# EasyEDA Pro project ProProject_IR sensor board_2024-06-21.epro, board PCB2 - newer_1
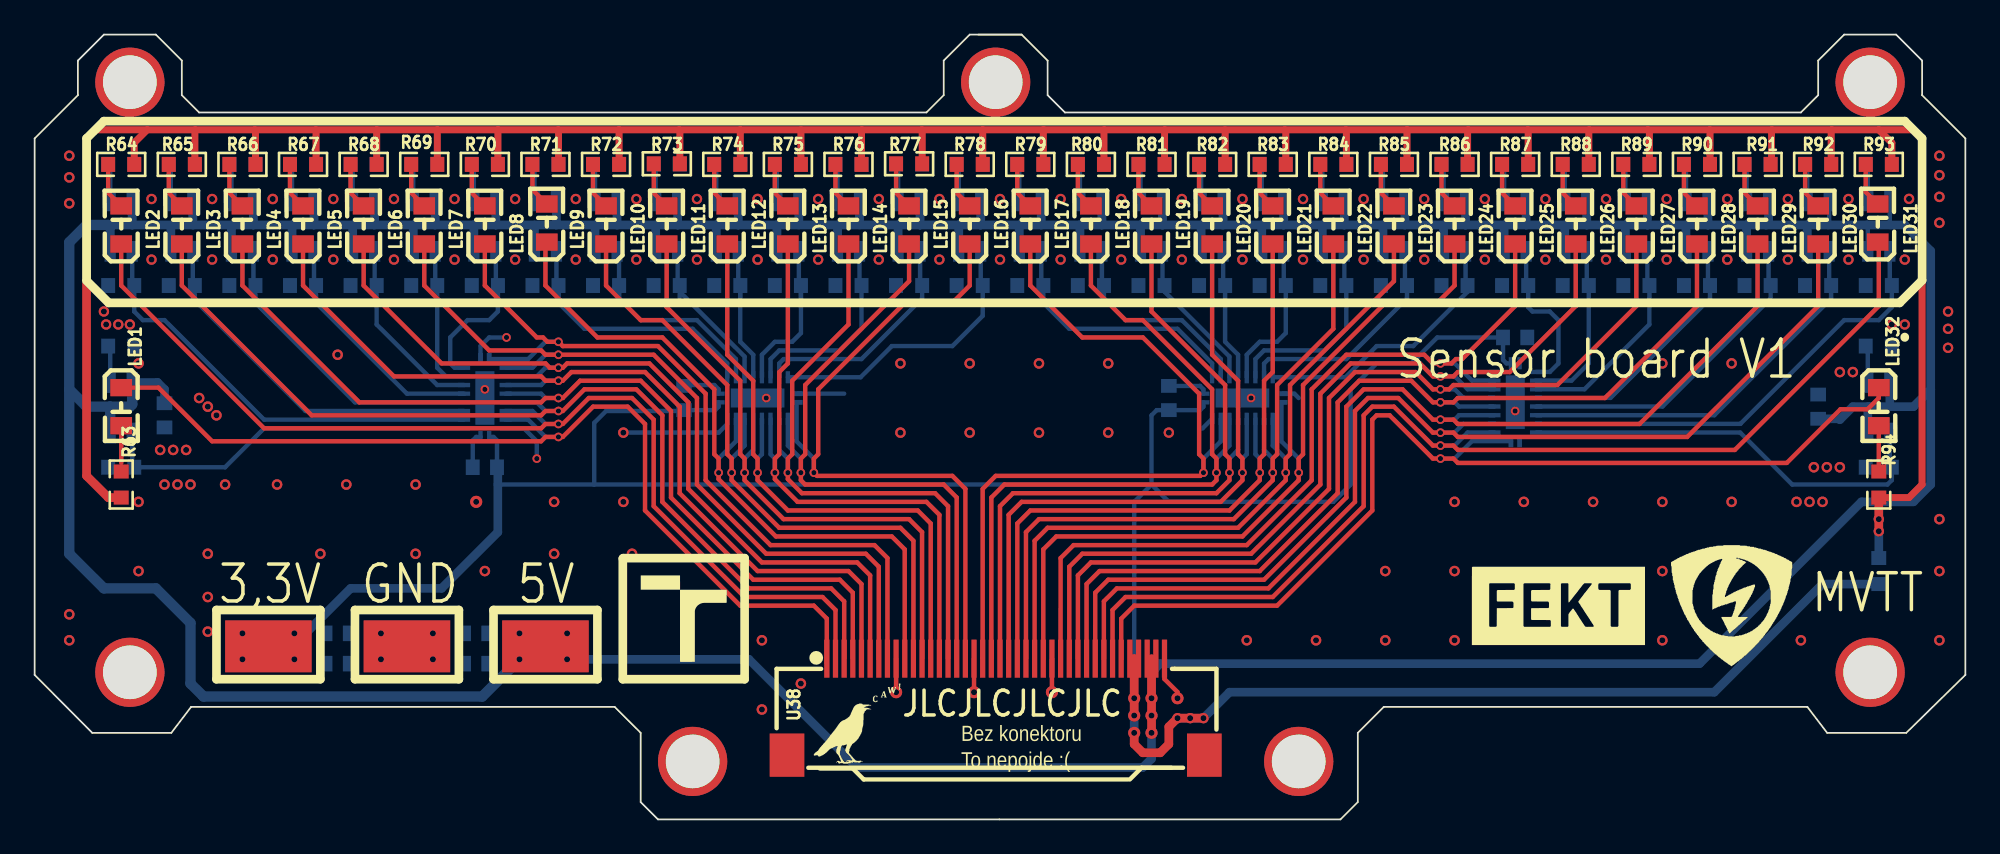
[diagram p7: board, top side]
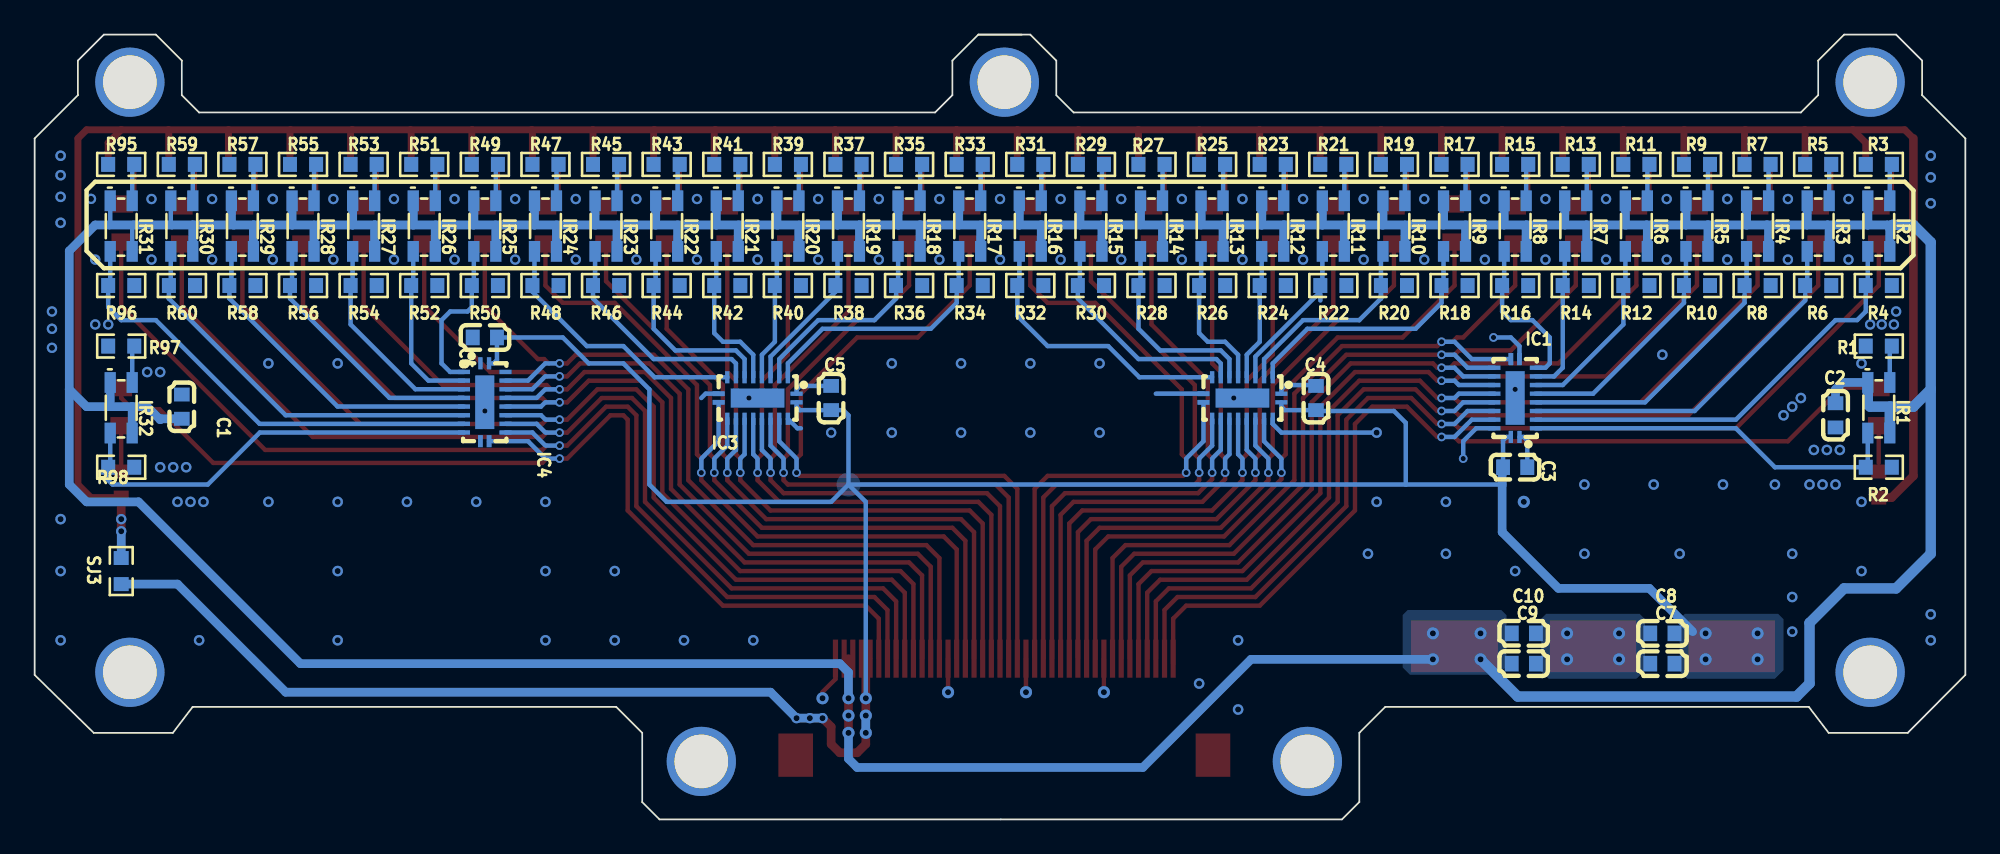
[diagram p8: board, bottom side, seen from below]

Outline 111.5 x 45.35 mm; copper layers: Top Layer, Bottom Layer. Coordinates in mm from the lower left corner of the outline.
Outline path: 54.5,45.35 57,45.35 ; 57,45.35 54,45.35 52.5,43.85 52.5,41.85 51.5,40.85 9.5,40.85 8.5,41.85 8.5,43.85 7,45.35 4,45.35 2.5,43.85 2.5,41.85 0,39.35 0,8.35 3.33,5 7.89,5 9.04,6.5 33.5,6.5 35,5 35,1 36,0 75.41,0 76.41,1 76.41,5 77.91,6.5 102.38,6.5 103.52,5 108.09,5 111.5,8.35 111.5,39.35 109,41.85 109,43.85 107.5,45.35 104.5,45.35 103,43.85 103,41.85 102,40.85 59.5,40.85 58.5,41.85 58.5,43.85 57,45.35
Stack: Top Layer 0.035mm / Dielectric1 1.51mm FR4 er 4.5 / Bottom Layer 0.035mm

## Design rules (mm)
template: JLCPCB Capability(Two Layers Board)
spacing copperThickness1oz (default): track to track 0.102, other pairs 0.152 to 0.3
spacing copperThickness2oz: track to track 0.203, other pairs 0.152 to 0.3
track width copperThickness1oz (default): min 0.127, default 0.254, max 2.54
track width copperThickness2oz: min 0.203, default 0.254, max 2.54
differential pair differentialPair (default): width min 0.127, default 0.254, max 2.54; gap min 0.152, default 0.152
via viaSize (default): diameter min 0.5, default 0.61, max 10; hole min 0.3, default 0.305, max 6.3

## Placement (name value [footprint] x y rotation side)
C1  100nF  [C0603]  103 23.85 90 bottom
C2  100nF  [C0603]  7.5 23.35 270 bottom
C3  100nF  [C0603]  26 20.35 180 bottom
C4  100nF  [C0603]  37.5 24.35 90 bottom
C5  100nF  [C0603]  65.5 24.35 90 bottom
C6  100nF  [C0603]  85.5 27.85 0 bottom
C7  1uF  [C0603]  17.5 9 0 bottom
C8  1uF  [C0603]  17.5 10.75 0 bottom
C9  1uF  [C0603]  25.5 9 180 bottom
C10  1uF  [C0603]  25.5 10.75 180 bottom
IC1  74AHC541BQ,115  [DHVQFN20_L4.5-W2.5-P0.50-BL-EP]  26 24.35 90 bottom
IC2  74AHC541BQ,115  [DHVQFN20_L4.5-W2.5-P0.50-BL-EP]  41.75 24.35 0 bottom
IC3  74AHC541BQ,115  [DHVQFN20_L4.5-W2.5-P0.50-BL-EP]  69.75 24.35 0 bottom
IC4  74AHC541BQ,115  [DHVQFN20_L4.5-W2.5-P0.50-BL-EP]  85.51 24.11 270 bottom
IR1  -  [KU163]  5 23.85 180 bottom
IR2  -  [KU163]  5 34.35 180 bottom
IR3  IR1  [KU163]  8.5 34.35 180 bottom
IR4  -  [KU163]  12 34.35 180 bottom
IR5  -  [KU163]  15.5 34.35 180 bottom
IR6  -  [KU163]  19 34.35 180 bottom
IR7  -  [KU163]  22.5 34.35 180 bottom
IR8  -  [KU163]  26 34.35 180 bottom
IR9  -  [KU163]  29.5 34.35 180 bottom
IR10  -  [KU163]  33 34.35 180 bottom
IR11  -  [KU163]  36.5 34.35 180 bottom
IR12  -  [KU163]  40 34.35 180 bottom
IR13  -  [KU163]  43.5 34.35 180 bottom
IR14  -  [KU163]  47 34.35 180 bottom
IR15  -  [KU163]  50.5 34.35 180 bottom
IR16  -  [KU163]  54 34.35 180 bottom
IR17  -  [KU163]  57.5 34.35 180 bottom
IR18  -  [KU163]  61 34.35 180 bottom
IR19  -  [KU163]  64.5 34.35 180 bottom
IR20  -  [KU163]  68 34.35 180 bottom
IR21  -  [KU163]  71.5 34.35 180 bottom
IR22  -  [KU163]  75 34.35 180 bottom
IR23  -  [KU163]  78.5 34.35 180 bottom
IR24  -  [KU163]  82 34.35 180 bottom
IR25  -  [KU163]  85.5 34.35 180 bottom
IR26  -  [KU163]  89 34.35 180 bottom
IR27  -  [KU163]  92.5 34.35 180 bottom
IR28  -  [KU163]  96 34.35 180 bottom
IR29  -  [KU163]  99.5 34.35 180 bottom
IR30  -  [KU163]  103 34.35 180 bottom
IR31  -  [KU163]  106.5 34.35 180 bottom
IR32  -  [KU163]  106.5 23.85 180 bottom
LED1  -  [LED0805-RD_GREEN]  5 23.85 270 top
LED2  -  [LED0805-RD_GREEN]  5 34.35 90 top
LED3  -  [LED0805-RD_GREEN]  8.5 34.35 90 top
LED4  -  [LED0805-RD_GREEN]  12 34.35 90 top
LED5  -  [LED0805-RD_GREEN]  15.5 34.35 90 top
LED6  -  [LED0805-RD_GREEN]  19 34.35 90 top
LED7  -  [LED0805-RD_GREEN]  22.5 34.35 90 top
LED8  -  [LED0805-RD_GREEN]  26 34.35 90 top
LED9  -  [LED0805-RD_GREEN]  29.58 34.46 90 top
LED10  -  [LED0805-RD_GREEN]  33 34.35 90 top
LED11  -  [LED0805-RD_GREEN]  36.5 34.35 90 top
LED12  -  [LED0805-RD_GREEN]  40 34.35 90 top
LED13  -  [LED0805-RD_GREEN]  43.5 34.35 90 top
LED14  -  [LED0805-RD_GREEN]  47 34.35 90 top
LED15  -  [LED0805-RD_GREEN]  50.5 34.35 90 top
LED16  -  [LED0805-RD_GREEN]  54 34.35 90 top
LED17  -  [LED0805-RD_GREEN]  57.5 34.35 90 top
LED18  -  [LED0805-RD_GREEN]  61 34.35 90 top
LED19  -  [LED0805-RD_GREEN]  64.5 34.35 90 top
LED20  -  [LED0805-RD_GREEN]  68 34.35 90 top
LED21  -  [LED0805-RD_GREEN]  71.5 34.35 90 top
LED22  -  [LED0805-RD_GREEN]  75 34.35 90 top
LED23  -  [LED0805-RD_GREEN]  78.5 34.35 90 top
LED24  -  [LED0805-RD_GREEN]  82 34.35 90 top
LED25  -  [LED0805-RD_GREEN]  85.5 34.35 90 top
LED26  -  [LED0805-RD_GREEN]  89 34.35 90 top
LED27  -  [LED0805-RD_GREEN]  92.5 34.35 90 top
LED28  -  [LED0805-RD_GREEN]  96 34.35 90 top
LED29  -  [LED0805-RD_GREEN]  99.5 34.35 90 top
LED30  -  [LED0805-RD_GREEN]  103 34.35 90 top
LED31  -  [LED0805-RD_GREEN]  106.44 34.46 90 top
LED32  -  [LED0805-RD_GREEN]  106.5 23.85 270 top
NOREF  -  [Pad_e8276]  106 42.6 0 top
NOREF#2  -  [Pad_e8278]  5.5 42.6 0 top
NOREF#3  -  [Pad_e223]  73 3.35 0 top
NOREF#4  -  [Pad_e8274]  55.5 42.6 0 top
NOREF#5  -  [Pad_e4472]  21.5 10 0 top
NOREF#6  -  [Pad_e4581]  13.5 10 0 top
NOREF#7  -  [Pad_e217]  38 3.35 0 top
NOREF#8  -  [Pad_e4440]  5.5 8.5 0 top
NOREF#9  -  [Pad_e4442]  106 8.5 0 top
NOREF#10  -  [Pad_e4480]  29.5 10 0 top
R1  680R  [R0603]  5 27.35 0 bottom
R2  6.2k  [R0603]  5 20.35 0 bottom
R3  680R  [R0603]  5 37.85 0 bottom
R4  6.2k  [R0603]  5 30.85 0 bottom
R5  680R  [R0603]  8.5 37.85 0 bottom
R6  6.2k  [R0603]  8.5 30.85 0 bottom
R7  680R  [R0603]  12 37.85 0 bottom
R8  6.2k  [R0603]  12 30.85 0 bottom
R9  680R  [R0603]  15.5 37.85 0 bottom
R10  6.2k  [R0603]  15.5 30.85 0 bottom
R11  680R  [R0603]  19 37.85 0 bottom
R12  6.2k  [R0603]  19 30.85 0 bottom
R13  680R  [R0603]  22.5 37.85 0 bottom
R14  6.2k  [R0603]  22.5 30.85 0 bottom
R15  680R  [R0603]  26 37.85 0 bottom
R16  6.2k  [R0603]  26 30.85 0 bottom
R17  680R  [R0603]  29.5 37.85 0 bottom
R18  6.2k  [R0603]  29.5 30.85 0 bottom
R19  680R  [R0603]  33 37.85 0 bottom
R20  6.2k  [R0603]  33 30.85 0 bottom
R21  680R  [R0603]  36.5 37.85 0 bottom
R22  6.2k  [R0603]  36.5 30.85 0 bottom
R23  680R  [R0603]  40 37.85 0 bottom
R24  6.2k  [R0603]  40 30.85 0 bottom
R25  680R  [R0603]  43.5 37.85 0 bottom
R26  6.2k  [R0603]  43.5 30.85 0 bottom
R27  680R  [R0603]  47 37.85 0 bottom
R28  6.2k  [R0603]  47 30.85 0 bottom
R29  680R  [R0603]  50.5 37.85 0 bottom
R30  6.2k  [R0603]  50.5 30.85 0 bottom
R31  680R  [R0603]  54 37.85 0 bottom
R32  6.2k  [R0603]  54 30.85 0 bottom
R33  680R  [R0603]  57.5 37.85 0 bottom
R34  6.2k  [R0603]  57.5 30.85 0 bottom
R35  680R  [R0603]  61 37.85 0 bottom
R36  6.2k  [R0603]  61 30.85 0 bottom
R37  680R  [R0603]  64.5 37.85 0 bottom
R38  6.2k  [R0603]  64.5 30.85 0 bottom
R39  680R  [R0603]  68 37.85 0 bottom
R40  6.2k  [R0603]  68 30.85 0 bottom
R41  680R  [R0603]  71.5 37.85 0 bottom
R42  6.2k  [R0603]  71.5 30.85 0 bottom
R43  680R  [R0603]  75 37.85 0 bottom
R44  6.2k  [R0603]  75 30.85 0 bottom
R45  680R  [R0603]  78.5 37.85 0 bottom
R46  6.2k  [R0603]  78.5 30.85 0 bottom
R47  680R  [R0603]  82 37.85 0 bottom
R48  6.2k  [R0603]  82 30.85 0 bottom
R49  680R  [R0603]  85.5 37.85 0 bottom
R50  6.2k  [R0603]  85.5 30.85 0 bottom
R51  680R  [R0603]  89 37.85 0 bottom
R52  6.2k  [R0603]  89 30.85 0 bottom
R53  680R  [R0603]  92.5 37.85 0 bottom
R54  6.2k  [R0603]  92.5 30.85 0 bottom
R55  680R  [R0603]  96 37.85 0 bottom
R56  6.2k  [R0603]  96 30.85 0 bottom
R57  680R  [R0603]  99.5 37.85 0 bottom
R58  6.2k  [R0603]  99.5 30.85 0 bottom
R59  680R  [R0603]  103 37.85 0 bottom
R60  6.2k  [R0603]  102.99 30.85 0 bottom
R63  1k  [R0603]  5 19.35 270 top
R64  1k  [R0603]  5 37.85 0 top
R65  1k  [R0603]  8.5 37.85 0 top
R66  1k  [R0603]  12 37.85 0 top
R67  1k  [R0603]  15.5 37.85 0 top
R68  1k  [R0603]  19 37.85 0 top
R69  1k  [R0603]  22.5 37.85 0 top
R70  1k  [R0603]  26 37.85 0 top
R71  1k  [R0603]  29.5 37.85 0 top
R72  1k  [R0603]  33 37.85 0 top
R73  1k  [R0603]  36.51 37.89 0 top
R74  1k  [R0603]  40 37.85 0 top
R75  1k  [R0603]  43.5 37.85 0 top
R76  1k  [R0603]  47 37.85 0 top
R77  1k  [R0603]  50.5 37.89 0 top
R78  1k  [R0603]  54 37.85 0 top
R79  1k  [R0603]  57.5 37.85 0 top
R80  1k  [R0603]  61 37.85 0 top
R81  1k  [R0603]  64.5 37.85 0 top
R82  1k  [R0603]  68 37.85 0 top
R83  1k  [R0603]  71.5 37.85 0 top
R84  1k  [R0603]  75 37.85 0 top
R85  1k  [R0603]  78.5 37.85 0 top
R86  1k  [R0603]  82 37.85 0 top
R87  1k  [R0603]  85.5 37.85 0 top
R88  1k  [R0603]  89 37.85 0 top
R89  1k  [R0603]  92.5 37.85 0 top
R90  1k  [R0603]  96 37.85 0 top
R91  1k  [R0603]  99.5 37.85 0 top
R92  1k  [R0603]  103 37.85 0 top
R93  1k  [R0603]  106.5 37.85 0 top
R94  1k  [R0603]  106.5 19.35 270 top
R95  680R  [R0603]  106.5 37.85 0 bottom
R96  6.2k  [R0603]  106.5 30.85 0 bottom
R97  680R  [R0603]  106.5 27.35 0 bottom
R98  6.2k  [R0603]  106.5 20.35 0 bottom
SJ3  10K  [R0603]  106.5 14.35 270 bottom
U38  XDFC-0520-40P  [CONN-SMD_40P-P0.50_F31L-1A7H1-21040]  55.5 6.5 0 top

## Footprints (pads in the part's own frame, mm; a bottom-side part is the same pattern mirrored in y, then rotated)
C0603
  rect 0.8x0.9 smd: 1(-0.7,0) 2(0.7,0)
CONN-SMD_40P-P0.50_F31L-1A7H1-21040
  rect 0.3x2.2 smd: 1(-9.75,2.788) 2(-9.25,2.788) 3(-8.75,2.788) 4(-8.25,2.788) 5(-7.75,2.788) 6(-7.25,2.788) 7(-6.75,2.788) 8(-6.25,2.788) 9(-5.75,2.788) 10(-5.25,2.788) 11(-4.75,2.788) 12(-4.25,2.788) 13(-3.75,2.788) 14(-3.25,2.788) 15(-2.75,2.788) 16(-2.25,2.788) 17(-1.75,2.788) 18(-1.25,2.788) 19(-0.75,2.788) 20(-0.25,2.788) 21(0.25,2.788) 22(0.75,2.788) 23(1.25,2.788) 24(1.75,2.788) 25(2.25,2.788) 26(2.75,2.788) 27(3.25,2.788) 28(3.75,2.788) 29(4.25,2.788) 30(4.75,2.788) 31(5.25,2.788) 32(5.75,2.788) 33(6.25,2.788) 34(6.75,2.788) 35(7.25,2.788) 36(7.75,2.788) 37(8.25,2.788) 38(8.75,2.788) 39(9.25,2.788) 40(9.75,2.788)
  rect 2x2.5 smd: 41(-12.05,-2.788) 42(12.05,-2.788)
DHVQFN20_L4.5-W2.5-P0.50-BL-EP
  rect 0.7x0.25 smd: 1(-2.251,-0.249) 20(-2.251,0.249)
  rect 0.25x0.7 smd: 2(-1.75,-1.2) 3(-1.25,-1.2) 4(-0.75,-1.2) 5(-0.25,-1.2) 6(0.25,-1.2) 7(0.75,-1.2) 8(1.25,-1.2) 9(1.75,-1.2) 12(1.75,1.2) 13(1.25,1.2) 14(0.75,1.2) 15(0.25,1.2) 16(-0.25,1.2) 17(-0.75,1.2) 18(-1.25,1.2) 19(-1.75,1.2)
  rect 0.7x0.28 smd: 10(2.251,-0.249) 11(2.251,0.251)
  rect 3.1x1.1 smd: 21(0,0.001)
KU163
  rect 0.65x1.2 smd: 1(-0.635,1.397) 2(0.635,1.397) 3(-0.635,-1.524) 4(0.635,-1.524)
LED0805-RD_GREEN
  rect 1x1.25 smd: 1(-1.1,0) 2(1.1,0)
Pad_e217
  round 4 hole 3.1: 1(0,0)
Pad_e223
  round 4 hole 3.1: 1(0,0)
Pad_e4440
  round 4 hole 3.1: 1(0,0)
Pad_e4442
  round 4 hole 3.1: 1(0,0)
Pad_e4472
  rect 5x3 smd: 2(0,0)
Pad_e4480
  rect 5x3 smd: 43(0,0)
Pad_e4581
  rect 5x3 smd: 44(0,0)
Pad_e8274
  round 4 hole 3.1: 45(0,0)
Pad_e8276
  round 4 hole 3.1: 45(0,0)
Pad_e8278
  round 4 hole 3.1: 45(0,0)
R0603
  rect 0.806x0.864 smd: 1(-0.753,0) 2(0.753,0)

## Nets
As in the schematic, except:
+5V: C1.1 C2.1 C9.1 C10.1 IR1.1 IR1.4 IR2.1 IR2.4 IR3.1 IR3.4 IR4.1 IR4.4 IR5.1 IR5.4 IR6.1 IR6.4 IR7.1 IR7.4 IR8.1 IR8.4 IR9.1 IR9.4 IR10.1 IR10.4 IR11.1 IR11.4 IR12.1 IR12.4 IR13.1 IR13.4 IR14.1 IR14.4 IR15.1 IR15.4 IR16.1 IR16.4 IR17.1 IR17.4 IR18.1 IR18.4 IR19.1 IR19.4 IR20.1 IR20.4 IR21.1 IR21.4 IR22.1 IR22.4 IR23.1 IR23.4 IR24.1 IR24.4 IR25.1 IR25.4 IR26.1 IR26.4 IR27.1 IR27.4 IR28.1 IR28.4 IR29.1 IR29.4 IR30.1 IR30.4 IR31.1 IR31.4 IR32.1 IR32.4 NOREF#10.43 U38.38 U38.39
AGND: C1.2 C2.2 C3.2 C4.2 C5.2 C6.2 C7.2 C8.2 C9.2 C10.2 IC1.1 IC1.10 IC1.19 IC1.21 IC2.1 IC2.10 IC2.19 IC2.21 IC3.1 IC3.10 IC3.19 IC3.21 IC4.1 IC4.10 IC4.19 IC4.21 NOREF.45 NOREF#2.45 NOREF#3.1 NOREF#4.45 NOREF#5.2 NOREF#7.1 NOREF#8.1 NOREF#9.1 R1.2 R2.1 R3.2 R4.1 R5.2 R6.1 R7.2 R8.1 R9.2 R10.1 R11.2 R12.1 R13.2 R14.1 R15.2 R16.1 R17.2 R18.1 R19.2 R20.1 R21.2 R22.1 R23.2 R24.1 R25.2 R26.1 R27.2 R28.1 R29.2 R30.1 R31.2 R32.1 R33.2 R34.1 R35.2 R36.1 R37.2 R38.1 R39.2 R40.1 R41.2 R42.1 R43.2 R44.1 R45.2 R46.1 R47.2 R48.1 R49.2 R50.1 R51.2 R52.1 R53.2 R54.1 R55.2 R56.1 R57.2 R58.1 R59.2 R60.1 R95.2 R96.1 R97.2 R98.1 U38.9 U38.18 U38.27 U38.40
VCC: C3.1 C4.1 C5.1 C6.1 C7.1 C8.1 IC1.20 IC2.20 IC3.20 IC4.20 NOREF#6.44 SJ3.2 U38.36 U38.37

Pads without a net: U38 41 42

## Via types
v1: diameter 0.7, hole 0.35, Top Layer to Bottom Layer, 23 vias
v2: diameter 0.61, hole 0.35, Top Layer to Bottom Layer, 83 vias
v3: diameter 0.6, hole 0.35, Top Layer to Bottom Layer, 67 vias
v4: diameter 0.5, hole 0.3, Top Layer to Bottom Layer, 38 vias

## Routing (per net, layer and track width the routed paths; a pad name or vN(x,y) marks a point on that pad's centre or on a via; arc(x,y) is an arc through that point)
+5V: length 374
  Top Layer w0.254: U38.38 U38.39
  Top Layer w0.5: v1(64.5,5) v1(64.5,6) v1(64.5,7) 64.5,7 64.5,9.29
  Bottom Layer w0.254: IR31.1 107.13,34.39 107.18,34.35 ; IR30.1 103.63,34.4 103.58,34.35 ; IR31.4 105.87,34.29 105.8,34.35
  Bottom Layer w0.5: 107.18,34.35 108,34.35 109.5,32.85 109.5,24.85 ; C1.1 104.2,23.15 104.25,23.1 105,23.85 105.88,23.85 ; 109.5,24.85 108.5,23.85 107.16,23.85 ; 109.5,24.85 109.5,19.35 108.5,18.35 105.5,18.35 96.15,9 65,9 64.5,8.5 v1(64.5,7) ; IR32.1 107.13,23.87 107.16,23.85 ; 105.88,23.85 105.87,23.83 IR32.4 ; 105.88,23.85 107.16,23.85 ; v1(64.5,5) 64.5,3.5 64,3 47.5,3 41.25,9.25 v1(30.75,9.25) ; C2.1 7.5,24.85 7.1,25.25 IR1.1
  Bottom Layer w0.508: IR11.1 37.13,34.35 37.14,34.35 ; 86.15,34.35 86.13,34.36 IR25.1 ; 86.15,34.35 89.64,34.35 ; 86.15,34.35 82.64,34.35 ; IR26.4 88.37,34.35 ; 33.65,34.35 30.14,34.35 ; 33.65,34.35 37.14,34.35 ; 33.65,34.35 33.63,34.36 IR10.1 ; 30.14,34.35 IR9.1 ; 30.14,34.35 26.64,34.35 ; 40.63,34.35 40.63,34.35 IR12.1 ; 40.63,34.35 42.86,34.35 ; 40.63,34.35 39.36,34.35 ; 9.15,34.35 9.14,34.36 IR3.1 ; 9.15,34.35 11.46,34.35 ; 9.15,34.35 7.96,34.35 ; 93.14,34.35 91.87,34.35 ; 93.14,34.35 96.63,34.35 ; 93.14,34.35 93.13,34.35 IR27.1 ; 91.87,34.35 91.87,34.35 IR27.4 ; 91.87,34.35 89.64,34.35 ; 61.63,34.35 61.63,34.36 IR18.1 ; 61.63,34.35 63.87,34.35 ; 61.63,34.35 60.37,34.35 ; 25.36,34.35 23.12,34.35 ; 25.36,34.35 25.36,34.34 IR8.4 ; 25.36,34.35 26.64,34.35 ; 23.12,34.35 21.89,34.35 ; 23.12,34.35 23.14,34.36 IR7.1 ; 102.37,34.35 107.18,34.35 ; 79.12,34.35 75.63,34.35 ; 79.12,34.35 82.64,34.35 ; 79.12,34.35 79.13,34.37 IR23.1 ; 75.63,34.35 75.63,34.36 IR22.1 ; 75.63,34.35 72.13,34.35 ; 5.64,34.35 4.5,34.35 4.36,34.21 IR2.4 ; 5.64,34.35 7.96,34.35 ; 5.64,34.35 5.64,34.35 IR2.1 ; 12.63,34.35 12.64,34.36 IR4.1 ; 12.63,34.35 11.46,34.35 ; 12.63,34.35 14.88,34.35 ; IR28.1 96.63,34.35 96.63,34.35 ; IR24.4 81.37,34.35 ; 42.86,34.35 42.87,34.34 IR13.4 ; 42.86,34.35 49.87,34.35 ; IR29.4 98.87,34.34 98.86,34.35 ; IR20.1 68.63,34.37 68.61,34.35 ; 82.64,34.35 82.63,34.35 IR24.1 ; 18.41,34.35 16.13,34.35 ; 18.41,34.35 19.61,34.35 ; 18.41,34.35 18.36,34.3 IR6.4 ; 16.13,34.35 14.88,34.35 ; 16.13,34.35 16.14,34.36 IR5.1 ; IR21.4 70.87,34.35 ; 19.61,34.35 19.64,34.37 IR6.1 ; 19.61,34.35 21.89,34.35 ; 96.63,34.35 98.86,34.35 ; 54.63,34.35 53.37,34.35 ; 54.63,34.35 54.63,34.35 IR16.1 ; 54.63,34.35 58.13,34.35 ; 53.37,34.35 53.37,34.35 IR16.4 ; 53.37,34.35 51.13,34.35 ; IR20.4 67.37,34.35 ; IR29.1 100.13,34.48 100,34.35 ; 49.87,34.35 49.87,34.35 IR15.4 ; 49.87,34.35 51.13,34.35 ; IR3.4 7.86,34.25 7.96,34.35 ; 65.14,34.35 63.87,34.35 ; 65.14,34.35 65.13,34.35 IR19.1 ; 65.14,34.35 68.61,34.35 ; 63.87,34.35 63.87,34.35 IR19.4 ; 14.88,34.35 14.86,34.34 IR5.4 ; 37.14,34.35 39.36,34.35 ; IR14.4 46.37,34.35 ; 11.46,34.35 11.36,34.26 IR4.4 ; IR11.4 35.87,34.35 ; 51.13,34.35 51.13,34.35 IR15.1 ; 89.64,34.35 89.63,34.36 IR26.1 ; IR30.4 102.37,34.35 100,34.35 ; IR28.4 95.37,34.35 ; 39.36,34.35 39.37,34.35 IR12.4 ; 58.13,34.35 60.37,34.35 ; 58.13,34.35 IR17.1 ; 72.13,34.35 72.13,34.35 IR21.1 ; 72.13,34.35 68.61,34.35 ; 21.89,34.35 21.86,34.33 IR7.4 ; 60.37,34.35 60.37,34.34 IR18.4 ; IR25.4 84.87,34.35 ; 100,34.35 98.86,34.35 ; IR13.1 44.13,34.35 ; IR17.4 56.87,34.35 ; IR22.4 74.37,34.35 ; IR9.4 28.86,34.35 ; IR14.1 47.63,34.35 ; IR23.4 77.87,34.35 ; 26.64,34.35 26.64,34.36 IR8.1 ; IR10.4 32.37,34.35
  Bottom Layer w0.6: 4.36,34.21 4.23,34.35 3,34.35 2,33.35 2,24.85 ; 2,24.85 2,15.35 4,13.35 7,13.35 9,11.35 9,7.85 9.75,7.1 25.85,7.1 v1(28,9.25) ; 2,24.85 3,23.85 4.36,23.85 ; IR1.1 5.64,23.98 5.5,23.85 4.36,23.85 ; IR1.4 4.36,23.84 4.36,23.85
  vias: v1(28,10.75) v1(30.75,10.75)
AGND: length 32.1
  Top Layer w0.254: v1(58.75,7.35) U38.27 ; v1(49.75,7.35) U38.9 ; U38.40 65.25,8.11 66,7.36 v1(66,7) ; v1(54.25,7.35) U38.18
  Bottom Layer w0.254: 73,24.35 72.75,24.6 IC3.10 ; IC3.19 67.45,22.6 67.25,22.6 ; IC1.19 28.25,22.6 29,21.85 v4(29,20.85) ; IC1.10 25.75,27.35 26.25,27.85 v4(27.25,27.85) ; v2(34,22.35) 39.5,22.35 40,22.85 IC2.19 ; IC2.1 39.5,24.85 39.25,25.1 37.55,25.1 C4.2 ; IC1.1 25.5,22.1 25.3,21.9 C3.2 ; IC2.10 46.75,24.6 ; C5.2 67.3,25.05 67.5,24.85 IC3.1
  vias: v1(20,10.75) v1(20,9.25) v1(23,10.75) v1(23,9.25) v1(25.5,18.35) v2(2,38.35) v2(2,37.1) v2(2,35.6) v2(2,11.85) v2(2,10.35) v2(6,26.35) v2(6,18.35) v2(6,14.35) v2(7.25,21.35) v2(7.5,19.35) v2(8,21.35) v2(8.25,19.35) v2(8.75,21.35) v2(9,19.35) v2(9.5,24.35) v2(10,23.85) v2(10,15.35) v2(10,12.85) v2(10,10.85) v2(10.5,23.35) v2(11,19.35) v2(13.75,35.85) v2(13.75,32.35) v2(14,19.35) v2(16.5,15.35) v2(17.5,26.85) v2(18,19.35) v2(22,19.35) v2(22,15.35) v2(26,14.35) v2(30,18.35) v2(30,15.35) v2(34,18.35) v2(34.5,15.35) v2(41.75,35.85) v2(41.75,32.35) v2(42,10.35) v2(42,6.35) v2(44.25,7.85) v2(50,26.35) v2(50,22.35) v2(54,26.35) v2(54,22.35) v2(58,26.35) v2(58,22.35) v2(62,26.35) v2(62,22.35) v2(69.75,35.85) v2(69.75,32.35) v2(70,10.35) v2(74,10.35) v2(78,14.35) v2(78,10.35) v2(82,18.35) v2(82,14.35) v2(82,10.35) v2(86,18.35) v2(90,18.35) v2(94,26.35) v2(94,18.35) v2(94,14.35) v2(94,10.35) v2(97.75,32.35) v2(97.75,35.85) v2(98,26.35) v2(98,18.35) v2(101.75,18.35) v2(102,10.35) v2(102.5,18.35) v2(102.75,20.35) v2(103.25,18.35) v2(103.5,20.35) v2(104.25,25.85) v2(104.25,20.35) v2(105,25.85) v2(110,38.35) v2(110,37.22) v2(110,35.97) v2(110,34.47) v2(110,17.35) v2(110,14.35) v2(110,10.35) v3(4,29.35) v3(4.13,28.6) v3(4.83,28.6) v3(5.5,28.6) v3(6.75,35.85) v3(6.75,32.35) v3(10.25,35.85) v3(10.25,32.35) v3(17.25,35.85) v3(17.25,32.35) v3(20.75,35.85) v3(20.75,32.35) v3(24.25,35.85) v3(24.25,32.35) v3(27.75,35.85) v3(27.75,32.35) v3(31.25,35.85) v3(31.25,32.35) v3(34.75,35.85) v3(34.75,32.35) v3(38.25,35.85) v3(38.25,32.35) v3(45.25,35.85) v3(45.25,32.35) v3(48.75,35.85) v3(48.75,32.35) v3(52.25,35.85) v3(52.25,32.35) v3(55.75,35.85) v3(55.75,32.35) v3(59.25,35.85) v3(59.25,32.35) v3(62.75,35.85) v3(62.75,32.35) v3(65.5,22.35) v3(66.25,35.85) v3(66.25,32.35) v3(73.25,35.85) v3(73.25,32.35) v3(76.75,32.35) v3(76.75,35.85) v3(80.25,35.85) v3(80.25,32.35) v3(83.75,32.35) v3(83.75,35.85) v3(87.25,35.85) v3(87.25,32.35) v3(90.75,32.35) v3(90.75,35.85) v3(94.25,35.85) v3(94.25,32.35) v3(101.25,35.85) v3(101.25,32.35) v3(104.75,32.35) v3(104.75,35.85) v3(107.25,28.6) v3(108,32.35) v3(108,28.6) v3(108.25,35.86) v3(110.5,29.35) v3(110.5,28.35) v3(110.5,27.25) v4(26,24.85) v4(42.25,24.35) v4(70.25,24.35) v4(85.5,23.6)
VCC: length 172.6
  Top Layer w0.254: U38.37 U38.36
  Top Layer w0.5: v3(67.5,5.85) v3(66.73,5.85) v3(66,5.85) 65.5,5.35 65.5,4.35 65,3.85 64,3.85 63.5,4.35 v1(63.5,5) ; v1(63.5,6) v1(63.5,7) 63.5,9.28 63.5,9.29
  Bottom Layer w0.254: IC3.20 67.5,23.85 67.3,23.65 66,23.65 ; C3.1 26.7,21.9 26.5,22.1 IC1.20 ; v1(63.5,7) 63.5,18.35 64.5,19.35 ; IC2.20 39.5,23.85 39.3,23.65 C4.1 37.45,23.6 33,23.6 32.32,22.92 32.32,19.35 ; 64.5,19.35 65.5,18.35 75,18.35 76,19.35 76,24.85 77.5,26.35 79.5,26.35 81,27.85 C6.1 84.8,26.55 85,26.35 85.25,26.35 IC4.20 ; 64.5,19.35 64.5,23.35 64.8,23.65 C5.1 ; 64.5,19.35 32.32,19.35 ; 32.32,19.35 26.75,19.35
  Bottom Layer w0.5: C3.1 26.75,20.3 26.75,16.6 23.5,13.35 18.25,13.35 15.75,10.85 ; v1(63.5,5) v1(63.5,6) ; v3(66,5.85) v3(66.73,5.85) v3(67.5,5.85) 69,7.35 97,7.35 103.25,13.6 SJ3.2
  vias: v1(12,10.75) v1(12,9.25) v1(15,10.75) v1(15,9.25)
DIR1: length 56.9
  Top Layer w0.254: 45.75,9 45.75,11.6 45,12.35 40.75,12.35 35.25,17.85 35.25,22.85 34.25,23.85 32.25,23.85 30.5,22.1 v4(30.25,22.1) 29.5,22.1 29.25,21.85 10.25,21.85 7.15,24.95 LED1.1
  Bottom Layer w0.254: v4(30.25,22.1) 29.5,22.1 28.5,23.1 IC1.18
DIR2: length 62
  Top Layer w0.254: LED2.1 5,30.85 13.25,22.6 29.25,22.6 29.5,22.85 v4(30.25,22.85) 30.5,22.85 32,24.35 34.5,24.35 35.75,23.1 35.75,18.1 41,12.85 45.5,12.85 46.25,12.1 U38.2
  Bottom Layer w0.254: v4(30.25,22.85) 29.5,22.85 28.75,23.6 IC1.17
DIR3: length 59
  Top Layer w0.254: LED3.1 8.5,30.85 16,23.35 29.25,23.35 29.5,23.6 v4(30.25,23.6) 30.5,23.6 31.75,24.85 34.75,24.85 36.25,23.35 36.25,18.35 41.25,13.35 46,13.35 46.75,12.6 U38.3
  Bottom Layer w0.254: IC1.16 29,24.1 29.5,23.6 v4(30.25,23.6)
DIR4: length 55.9
  Top Layer w0.254: LED4.1 12,30.85 18.75,24.1 29.25,24.1 29.5,24.35 v4(30.25,24.35) 30.5,24.35 31.5,25.35 35,25.35 36.75,23.6 36.75,18.6 41.5,13.85 46.5,13.85 47.25,13.1 U38.4
  Bottom Layer w0.254: v4(30.25,24.35) 29.5,24.35 29.25,24.6 IC1.15
DIR5: length 52.6
  Top Layer w0.254: U38.5 47.75,13.6 47,14.35 41.75,14.35 37.25,18.85 37.25,23.85 35.25,25.85 31,25.85 30.5,25.35 v4(30.25,25.35) 29.5,25.35 29.25,25.6 20.75,25.6 15.5,30.85 LED5.1
  Bottom Layer w0.254: v4(30.25,25.35) 29.5,25.35 29.25,25.1 IC1.14
DIR6: length 49.8
  Top Layer w0.254: U38.6 48.25,14.1 47.5,14.85 42,14.85 37.75,19.1 37.75,24.1 35.5,26.35 30.75,26.35 30.5,26.1 v4(30.25,26.1) 29.75,26.1 29.5,26.35 23.5,26.35 19,30.85 LED6.1
  Bottom Layer w0.254: IC1.13 29,25.6 29.5,26.1 v4(30.25,26.1)
DIR7: length 47
  Top Layer w0.254: U38.7 48.75,14.6 48,15.35 42.25,15.35 38.25,19.35 38.25,24.35 35.75,26.85 v4(30.25,26.85) 29.5,26.85 29.25,27.1 26.25,27.1 22.5,30.85 LED7.1
  Bottom Layer w0.254: IC1.12 28.75,26.1 29.5,26.85 v4(30.25,26.85)
DIR8: length 45.3
  Top Layer w0.254: U38.8 49.25,15.1 48.5,15.85 42.5,15.85 38.75,19.6 38.75,24.6 36,27.35 30.5,27.35 v4(30.25,27.6) 29.61,27.6 29.36,27.85 29,27.85 26,30.85 LED8.1
  Bottom Layer w0.254: v4(30.25,27.6) 29.5,27.6 28.5,26.6 IC1.11
DIR9: length 42.3
  Top Layer w0.254: LED9.1 29.5,33.28 29.5,30.85 32.5,27.85 36.25,27.85 39.25,24.85 39.25,21.1 39.5,20.85 v4(39.5,20.04) 39.5,19.66 42.81,16.35 49.5,16.35 50.25,15.6 U38.10
  Bottom Layer w0.254: IC2.18 40.5,21.85 39.5,20.85 ; 39.5,20.79 v4(39.5,20.04)
DIR10: length 39.5
  Top Layer w0.254: U38.11 50.75,16.1 50,16.85 43,16.85 40.25,19.6 v4(40.25,20.04) 40.25,20.85 40,21.1 40,25.1 36.25,28.85 35,28.85 33,30.85 LED10.1
  Bottom Layer w0.254: IC2.17 41,21.6 40.25,20.85 ; 40.25,20.79 v4(40.25,20.04)
DIR11: length 37.6
  Top Layer w0.254: LED11.1 36.5,29.6 40.75,25.35 40.75,21.1 41,20.85 v4(41,20.04) 41,19.6 43.25,17.35 50.5,17.35 51.25,16.6 U38.12
  Bottom Layer w0.254: 41,20.79 v4(41,20.04) ; IC2.16 41.5,21.35 41,20.85
DIR12: length 36.4
  Top Layer w0.254: LED12.1 40,26.85 41.5,25.35 41.5,21.1 41.75,20.85 v4(41.75,20.04) 41.75,19.6 43.5,17.85 51,17.85 51.75,17.1 U38.13
  Bottom Layer w0.254: 41.75,20.85 42,21.1 IC2.15 ; 41.75,20.79 v4(41.75,20.04)
DIR13: length 35.7
  Top Layer w0.254: U38.14 52.25,17.6 51.5,18.35 44.06,18.35 42.75,19.66 v4(42.75,20.04) 42.75,20.85 43,21.1 43,25.85 43.5,26.35 LED13.1
  Bottom Layer w0.254: 42.75,20.79 v4(42.75,20.04) ; IC2.14 42.5,21.1 42.75,20.85
DIR14: length 37
  Top Layer w0.254: U38.15 52.75,18.1 52,18.85 44.31,18.85 43.5,19.66 v4(43.5,20.04) 43.5,20.85 43.75,21.1 43.75,25.35 47,28.6 LED14.1
  Bottom Layer w0.254: IC2.13 43,21.35 43.5,20.85 ; 43.5,20.79 v4(43.5,20.04)
DIR15: length 38.3
  Top Layer w0.254: LED15.1 50.5,31.1 44.5,25.1 44.5,21.1 44.25,20.85 v4(44.25,20.04) 44.25,19.6 44.5,19.35 52.5,19.35 53.25,18.6 U38.16
  Bottom Layer w0.254: 44.25,20.79 v4(44.25,20.04) ; 44.25,20.85 43.5,21.6 IC2.12
DIR16: length 41.9
  Top Layer w0.254: LED16.1 54,30.85 53,29.85 50.25,29.85 45.25,24.85 45.25,21.1 45,20.85 v4(45,20.04) 45.19,19.85 53,19.85 53.75,19.1 U38.17
  Bottom Layer w0.254: 45,20.85 44,21.85 IC2.11 ; 45,20.79 v4(45,20.04)
DIR17: length 46
  Top Layer w0.254: 54.75,9.29 U38.19 54.75,19.1 55.5,19.85 67.31,19.85 v4(67.5,20.04) 67.5,20.85 67.25,21.1 67.25,24.6 64,27.85 60.5,27.85 57.5,30.85 57.5,33.28 57.58,33.36
  Bottom Layer w0.254: IC3.18 68.5,21.85 67.5,20.85 ; 67.5,20.79 v4(67.5,20.04)
DIR18: length 43.3
  Top Layer w0.254: LED18.1 61,30.85 63,28.85 64,28.85 68,24.85 68,21.1 68.25,20.85 v4(68.25,20.04) 68.25,19.6 68,19.35 56,19.35 55.25,18.6 U38.20
  Bottom Layer w0.254: 68.25,20.79 v4(68.25,20.04) ; IC3.17 69,21.6 68.25,20.85
DIR19: length 41.5
  Top Layer w0.254: LED19.1 64.5,29.35 68.75,25.1 68.75,21.1 69,20.85 v4(69,20.04) 69,19.6 68.25,18.85 56.5,18.85 55.75,18.1 U38.21
  Bottom Layer w0.254: 69,20.79 v4(69,20.04) ; IC3.16 69.5,21.35 69,20.85
DIR20: length 40.2
  Top Layer w0.254: LED20.1 68,26.85 69.5,25.35 69.5,21.1 69.75,20.85 v4(69.75,20.04) 69.75,19.6 68.5,18.35 57,18.35 56.25,17.6 U38.22
  Bottom Layer w0.254: IC3.15 70,21.1 69.75,20.85 ; 69.75,20.79 v4(69.75,20.04)
DIR21: length 40
  Top Layer w0.254: LED21.1 71.5,25.85 71,25.35 71,21.1 70.75,20.85 v4(70.75,20.04) 70.75,19.6 69,17.85 57.5,17.85 56.75,17.1 U38.23
  Bottom Layer w0.254: IC3.14 70.5,21.1 70.75,20.85 ; 70.75,20.79 v4(70.75,20.04)
DIR22: length 41.2
  Top Layer w0.254: LED22.1 75,28.35 71.75,25.1 71.75,21.1 71.5,20.85 v4(71.5,20.04) 71.5,19.6 69.25,17.35 58,17.35 57.25,16.6 U38.24
  Bottom Layer w0.254: 71.5,20.79 v4(71.5,20.04) ; IC3.13 71,21.35 71.5,20.85
DIR23: length 42.4
  Top Layer w0.254: LED23.1 78.5,31.1 72.5,25.1 72.5,21.1 72.25,20.85 v4(72.25,20.04) 72.25,19.6 69.5,16.85 58.5,16.85 57.75,16.1 U38.25
  Bottom Layer w0.254: IC3.12 71.5,21.6 72.25,20.85 ; 72.25,20.79 v4(72.25,20.04)
DIR24: length 46.3
  Top Layer w0.254: U38.26 58.25,15.6 59,16.35 69.75,16.35 73,19.6 v4(73,20.04) 73,20.85 73.25,21.1 73.25,25.1 78,29.85 81,29.85 82,30.85 LED24.1
  Bottom Layer w0.254: IC3.11 72,21.85 73,20.85 ; 73,20.79 v4(73,20.04)
DIR25: length 48.6
  Top Layer w0.254: U38.28 59.25,15.1 60,15.85 70,15.85 73.75,19.6 73.75,24.85 75.75,26.85 80.25,26.85 80.75,26.35 v4(81.19,26.35) 81.83,26.35 82.08,26.6 82.44,26.6 85.5,29.66 LED25.1
  Bottom Layer w0.254: 83.01,25.36 82.01,26.36 ; 81.94,26.35 v4(81.19,26.35) ; IC4.18 83.01,25.36
DIR26: length 51.4
  Top Layer w0.254: U38.29 59.75,14.6 60.5,15.35 70.25,15.35 74.25,19.35 74.25,24.6 76,26.35 80,26.35 80.75,25.6 v4(81.19,25.6) 81.94,25.6 82.19,25.85 85.19,25.85 89,29.66 LED26.1
  Bottom Layer w0.254: IC4.17 82.76,24.86 ; 81.94,25.6 v4(81.19,25.6) ; 82.76,24.86 82.01,25.61
DIR27: length 54.3
  Top Layer w0.254: LED27.1 92.5,29.66 87.94,25.1 81.94,25.1 81.69,24.85 v4(81.19,24.85) 80.75,24.85 79.75,25.85 76.25,25.85 74.75,24.35 74.75,19.1 70.5,14.85 61,14.85 60.25,14.1 U38.30
  Bottom Layer w0.254: 82.01,24.86 82.51,24.36 IC4.16 ; 81.94,24.85 v4(81.19,24.85)
DIR28: length 57.1
  Top Layer w0.254: U38.31 60.75,13.6 61.5,14.35 70.75,14.35 75.25,18.85 75.25,24.1 76.5,25.35 79.5,25.35 80.75,24.1 v4(81.19,24.1) 81.94,24.1 82.19,24.35 90.69,24.35 96,29.66 LED28.1
  Bottom Layer w0.254: 81.94,24.1 v4(81.19,24.1) ; 82.01,24.11 82.26,23.86 84.31,23.86
DIR29: length 60.4
  Top Layer w0.254: LED29.1 99.5,29.66 92.69,22.85 82.19,22.85 81.94,23.1 v4(81.19,23.1) 80.75,23.1 79,24.85 76.75,24.85 75.75,23.85 75.75,18.6 71,13.85 62,13.85 61.25,13.1 U38.32
  Bottom Layer w0.254: 82.01,23.11 82.26,23.36 IC4.14 ; 81.94,23.1 v4(81.19,23.1)
DIR30: length 63.4
  Top Layer w0.254: LED30.1 103,29.66 95.44,22.1 82.19,22.1 81.94,22.35 v4(81.19,22.35) 80.75,22.35 78.75,24.35 77,24.35 76.25,23.6 76.25,18.35 71.25,13.35 62.5,13.35 61.75,12.6 U38.33
  Bottom Layer w0.254: 81.94,22.35 v4(81.19,22.35) ; 82.01,22.36 82.51,22.86 IC4.13
DIR31: length 66.6
  Top Layer w0.254: U38.34 62.25,12.1 63,12.85 71.5,12.85 76.75,18.1 76.75,23.35 77.25,23.85 78.5,23.85 80.75,21.6 v4(81.19,21.6) 81.94,21.6 82.19,21.35 98.19,21.35 106.5,29.66 106.5,33.3 LED31.1
  Bottom Layer w0.254: IC4.12 82.76,22.36 82.01,21.61 ; 81.94,21.6 v4(81.19,21.6)
DIR32: length 61.7
  Top Layer w0.254: LED32.1 106.5,24.35 105.85,23.7 104.29,23.7 101.19,20.6 82.19,20.6 81.94,20.85 v4(81.19,20.85) 80.75,20.85 78.25,23.35 77.5,23.35 77.25,23.1 77.25,17.85 71.75,12.35 63.5,12.35 62.75,11.6 U38.35
  Bottom Layer w0.254: 82.01,20.86 83.01,21.86 IC4.11 ; 81.94,20.85 v4(81.19,20.85)
IR1: length 22
  Bottom Layer w0.254: IC1.2 13.25,22.6 11,20.35 R2.2 5.64,20.47 IR1.3
IR2: length 25.2
  Bottom Layer w0.254: IR2.3 5.64,30.97 R4.2 5.75,29.35 5.75,29.35 6.25,28.85 7.5,28.85 13.25,23.1 IC1.3
IR3: length 20.6
  Bottom Layer w0.254: 9.25,30.35 9.25,29.99 15.64,23.6 IC1.4 ; IR3.3 9.14,30.97 R6.2 9.25,30.85
IR4: length 17
  Bottom Layer w0.254: 12.75,30.85 R8.2 12.64,30.97 IR4.3 ; IC1.5 18.5,24.1 12.75,29.85 12.75,30.35
IR5: length 13.3
  Bottom Layer w0.254: 16.25,30.35 16.25,29.85 21.5,24.6 IC1.6 ; IR5.3 16.14,30.97 R10.2 16.25,30.85
IR6: length 10.3
  Bottom Layer w0.254: 19.75,30.85 R12.2 19.64,30.97 IR6.3 ; 19.75,30.35 19.75,28.6 23.25,25.1 IC1.7
IR7: length 8.5
  Bottom Layer w0.254: IR7.3 23.14,30.97 R14.2 23.25,30.85 23.25,26.1 23.75,25.6 IC1.8
IR8: length 9.3
  Bottom Layer w0.254: IC1.9 24.25,26.1 24,26.35 24,27.85 25,28.85 26.25,28.85 26.75,29.35 R16.2 26.64,30.97 IR8.3
IR9: length 15.8
  Bottom Layer w0.254: IC2.2 40,26.35 38,28.35 31.75,28.35 30.25,29.85 30.25,30.85 R18.2 ; R18.2 30.25,30.1 ; R18.2 30.14,30.97 IR9.3
IR10: length 12.8
  Bottom Layer w0.254: 33.75,30.1 35,28.85 38.25,28.85 40.5,26.6 IC2.3 ; 33.75,30.1 33.75,30.1 33.75,32.71 IR10.3 ; 33.75,30.1 R20.2
IR11: length 9.2
  Bottom Layer w0.254: IR11.3 37.13,30.97 R22.2 37.25,30.49 41,26.74 IC2.4 ; 37.25,29.99 37.25,30.35
IR12: length 8.4
  Bottom Layer w0.254: IC2.5 41.5,26.85 40.75,27.6 40.75,30.85 ; 40.75,30.85 R24.2 ; 40.75,30.85 40.75,30.1 ; 40.75,30.85 R24.2 ; R24.2 40.63,30.97 IR12.3
IR13: length 9.6
  Bottom Layer w0.254: 44.25,30.1 44.25,30.85 R26.2 ; 44.25,30.1 R26.2 ; 44.25,30.1 44.25,28.1 43.75,27.6 42.75,27.6 42,26.85 IC2.6 ; R26.2 44.13,30.97 IR13.3
IR14: length 11.6
  Bottom Layer w0.254: IC2.7 42.5,26.6 43,27.1 46.5,27.1 47.75,28.35 47.75,30.85 R28.2 47.63,30.97 IR14.3
IR15: length 13.4
  Bottom Layer w0.254: IR15.3 51.13,30.97 R30.2 51.25,30.1 47.75,26.6 43.25,26.6 43,26.35 IC2.8
IR16: length 16.5
  Bottom Layer w0.254: IR16.3 54.63,30.97 R32.2 54.75,30.85 54.75,29.1 53,27.35 49.5,27.35 47.7,25.55 IC2.9
IR17: length 15
  Bottom Layer w0.254: IC3.2 68,26.35 66,28.35 59.75,28.35 58.25,29.85 58.25,30.85 R34.2 58.13,30.97 IR17.3
IR18: length 12
  Bottom Layer w0.254: IC3.3 68.5,26.6 66.25,28.85 63,28.85 61.75,30.1 61.75,30.85 R36.2 61.63,30.97 IR18.3
IR19: length 8.9
  Bottom Layer w0.254: IR19.3 65.13,30.97 R38.2 65.25,30.49 69,26.74 IC3.4
IR20: length 7.6
  Bottom Layer w0.254: IC3.5 69.5,26.85 68.75,27.6 68.75,30.85 R40.2 68.63,30.97 IR20.3
IR21: length 8.8
  Bottom Layer w0.254: IR21.3 72.13,30.97 R42.2 72.25,28.1 71.75,27.6 70.75,27.6 70,26.85 IC3.6
IR22: length 11.6
  Bottom Layer w0.254: IR22.3 75.63,30.97 R44.2 75.75,30.85 75.75,28.35 74.5,27.1 71,27.1 70.5,26.6 IC3.7
IR23: length 13.2
  Bottom Layer w0.254: IR23.3 79.13,30.97 ; IC3.8 71,26.35 71.25,26.6 75.75,26.6 79.25,30.1 R46.2
IR24: length 15.7
  Bottom Layer w0.254: IC3.9 75.7,25.55 77.5,27.35 79.61,27.35 82.75,30.49 82.75,30.85 R48.2 82.63,30.97 IR24.3
IR25: length 9.3
  Bottom Layer w0.254: IC4.2 87.51,25.86 88,26.35 88,28.85 87.5,29.35 86.5,29.35 86.25,29.6 R50.2 86.13,30.97 IR25.3
IR26: length 10
  Bottom Layer w0.254: IR26.3 89.63,30.97 R52.2 89.75,30.85 89.75,26.35 88.76,25.36 IC4.3
IR27: length 12.4
  Bottom Layer w0.254: IR27.3 93.13,30.97 R54.2 93.25,30.1 93.25,30.1 93.25,28.6 89.51,24.86 IC4.4
IR28: length 15.2
  Bottom Layer w0.254: IR28.3 96.63,30.97 R56.2 96.75,30.1 91.01,24.36 IC4.5
IR29: length 18.9
  Bottom Layer w0.254: IR29.3 100.13,30.97 R58.2 100.25,30.1 94.01,23.86 86.71,23.86
IR30: length 22.6
  Bottom Layer w0.254: IC4.7 97.01,23.36 103.75,30.1 103.75,30.1 103.75,30.85 103.63,30.96 IR30.3
IR31: length 26.6
  Bottom Layer w0.254: IR31.3 107.13,30.97 R96.2 107.25,30.1 ; 107.25,30.1 107.25,29.6 106.5,28.85 104.5,28.85 98.51,22.86 IC4.8 ; 107.25,30.1 107.25,30.1
IR32: length 24.7
  Bottom Layer w0.254: IR32.3 107.13,20.47 R98.2 107.25,19.6 107,19.35 101.5,19.35 98.49,22.36 IC4.9
$1N6653: length 2.2
  Bottom Layer w0.254: IR2.2 4.36,37.73 R3.1
$1N6781: length 2.2
  Bottom Layer w0.254: IR3.2 7.86,37.73 R5.1
$1N6909: length 2.2
  Bottom Layer w0.254: R7.1 11.36,37.73 IR4.2
$1N7037: length 2.2
  Bottom Layer w0.254: IR5.2 14.86,37.73 R9.1
$1N7165: length 2.2
  Bottom Layer w0.254: R11.1 18.36,37.73 IR6.2
$1N7293: length 2.2
  Bottom Layer w0.254: R13.1 21.86,37.73 IR7.2
$1N7421: length 2.2
  Bottom Layer w0.254: IR8.2 25.36,37.73 R15.1
$1N7549: length 2.2
  Bottom Layer w0.254: R17.1 28.86,37.73 IR9.2
$1N7677: length 2.2
  Bottom Layer w0.254: IR10.2 32.37,37.73 R19.1
$1N7805: length 2.2
  Bottom Layer w0.254: IR11.2 35.87,37.73 R21.1
$1N7933: length 2.2
  Bottom Layer w0.254: R23.1 39.37,37.73 IR12.2
$1N8061: length 2.2
  Bottom Layer w0.254: IR13.2 42.87,37.73 R25.1
$1N8189: length 2.2
  Bottom Layer w0.254: IR14.2 46.37,37.73 R27.1
$1N8317: length 2.2
  Bottom Layer w0.254: IR15.2 49.87,37.73 R29.1
$1N8445: length 2.2
  Bottom Layer w0.254: IR16.2 53.37,37.73 R31.1
$1N10253: length 2.2
  Bottom Layer w0.254: IR17.2 56.87,37.73 R33.1
$1N10265: length 2.2
  Bottom Layer w0.254: IR18.2 60.37,37.73 R35.1
$1N10277: length 2.2
  Bottom Layer w0.254: R37.1 63.87,37.73 IR19.2
$1N10289: length 2.2
  Bottom Layer w0.254: IR20.2 67.37,37.73 R39.1
$1N10301: length 2.2
  Bottom Layer w0.254: IR21.2 70.87,37.73 R41.1
$1N10313: length 2.2
  Bottom Layer w0.254: R43.1 74.37,37.73 IR22.2
$1N10325: length 2.2
  Bottom Layer w0.254: IR23.2 77.87,37.73 R45.1
$1N10337: length 2.2
  Bottom Layer w0.254: R47.1 81.37,37.73 IR24.2
$1N10349: length 2.2
  Bottom Layer w0.254: IR25.2 84.87,37.73 R49.1
$1N10361: length 2.3
  Bottom Layer w0.254: 88.15,37.93 88.37,37.71 IR26.2
$1N10373: length 2.2
  Bottom Layer w0.254: IR27.2 91.87,37.73 R53.1
$1N10385: length 2.2
  Bottom Layer w0.254: R55.1 95.37,37.73 IR28.2
$1N10397: length 2.2
  Bottom Layer w0.254: IR29.2 98.87,37.73 R57.1
$1N10409: length 2.2
  Bottom Layer w0.254: R59.1 102.37,37.73 IR30.2
$1N20190: length 2.2
  Top Layer w0.254: LED1.2 5,22.75 5,20.6
$1N20287: length 2.7
  Top Layer w0.254: R64.1 4.25,36.2 LED2.2
$1N20383: length 2.7
  Top Layer w0.254: LED3.2 7.75,36.2 R65.1
$1N20385: length 2.7
  Top Layer w0.254: LED4.2 11.25,36.2 R66.1
$1N20575: length 2.7
  Top Layer w0.254: R67.1 14.75,36.2 LED5.2
$1N20577: length 2.7
  Top Layer w0.254: R68.1 18.25,36.2 LED6.2
$1N20579: length 2.7
  Top Layer w0.254: LED7.2 21.75,36.2 R69.1
$1N20581: length 2.7
  Top Layer w0.254: LED8.2 25.25,36.2 R70.1
$1N20959: length 2.6
  Top Layer w0.254: R71.1 28.75,36.39 LED9.2
$1N20961: length 2.7
  Top Layer w0.254: R72.1 32.25,36.2 LED10.2
$1N20963: length 2.7
  Top Layer w0.254: R73.1 35.76,36.19 LED11.2
$1N20965: length 2.7
  Top Layer w0.254: LED12.2 39.25,36.2 R74.1
$1N20967: length 2.7
  Top Layer w0.254: R75.1 42.75,36.2 LED13.2
$1N20969: length 2.7
  Top Layer w0.254: R76.1 46.25,36.2 LED14.2
$1N20971: length 2.7
  Top Layer w0.254: R77.1 49.75,36.2 LED15.2
$1N20973: length 2.7
  Top Layer w0.254: LED16.2 53.25,36.2 R78.1
$1N22511: length 2.7
  Top Layer w0.254: R79.1 56.75,36.2 LED17.2
$1N22513: length 2.7
  Top Layer w0.254: R80.1 60.25,36.2 LED18.2
$1N22515: length 2.7
  Top Layer w0.254: LED19.2 63.75,36.2 R81.1
$1N22517: length 2.7
  Top Layer w0.254: LED20.2 67.25,36.2 R82.1
$1N22519: length 2.7
  Top Layer w0.254: R83.1 70.75,36.2 LED21.2
$1N22521: length 2.7
  Top Layer w0.254: R84.1 74.25,36.2 LED22.2
$1N22523: length 2.7
  Top Layer w0.254: R85.1 77.75,36.2 LED23.2
$1N22525: length 2.7
  Top Layer w0.254: R86.1 81.25,36.2 LED24.2
$1N22527: length 2.7
  Top Layer w0.254: LED25.2 84.75,36.2 R87.1
$1N22529: length 2.7
  Top Layer w0.254: R88.1 88.25,36.2 LED26.2
$1N22531: length 2.7
  Top Layer w0.254: LED27.2 91.75,36.2 R89.1
$1N22533: length 2.7
  Top Layer w0.254: LED28.2 95.25,36.2 R90.1
$1N22535: length 2.7
  Top Layer w0.254: R91.1 98.75,36.2 LED29.2
$1N22537: length 2.7
  Top Layer w0.254: LED30.2 102.25,36.2 R92.1
$1N22539: length 2.6
  Top Layer w0.254: LED31.2 105.75,36.25 R93.1
$1N22541: length 2.4
  Top Layer w0.254: LED32.2 106.5,22.75 106.5,20.35
$1N26335: length 2.2
  Bottom Layer w0.254: IR1.2 4.36,27.23 R1.1
$1N29013: length 215.6
  Top Layer w0.4: 89.79,39.85 89.75,39.81 R88.2 ; 89.79,39.85 93.16,39.85 ; 89.79,39.85 86.23,39.85 ; R72.2 33.75,39.84 33.75,39.85 ; R65.2 9.25,39.83 9.27,39.85 ; R93.2 107.25,39.1 106.5,39.85 ; R91.2 100.31,37.9 100.31,39.85 ; 47.77,39.85 47.75,39.83 R76.2 ; 47.77,39.85 51.23,39.85 ; 47.77,39.85 40.76,39.85 ; 6.5,39.85 3.5,39.85 3,39.35 ; 6.5,39.85 5.75,39.1 R64.2 ; 6.5,39.85 9.27,39.85 ; R94.2 108.25,18.6 109,19.35 109,39.35 108.5,39.85 106.5,39.85 ; 19.75,39.85 19.75,39.84 R68.2 ; 19.75,39.85 23.26,39.85 ; 19.75,39.85 16.24,39.85 ; 51.23,39.85 54.75,39.85 ; 51.23,39.85 51.26,39.82 R77.2 ; 100.31,39.85 96.73,39.85 ; 100.31,39.85 103.78,39.85 ; R67.2 16.25,39.83 16.24,39.85 ; 12.71,39.85 9.27,39.85 ; 12.71,39.85 16.24,39.85 ; 12.71,39.85 12.75,39.81 R66.2 ; 40.76,39.85 37.23,39.85 ; 40.76,39.85 40.75,39.84 R74.2 ; 75.72,39.85 72.2,39.85 ; 75.72,39.85 75.75,39.81 R84.2 ; 75.72,39.85 79.26,39.85 ; 72.2,39.85 72.25,39.79 R83.2 ; 72.2,39.85 65.27,39.85 ; 93.16,39.85 96.73,39.85 ; 93.16,39.85 93.25,39.76 R89.2 ; 23.26,39.85 23.25,39.84 R69.2 ; 23.26,39.85 26.76,39.85 ; 82.79,39.85 79.26,39.85 ; 82.79,39.85 86.23,39.85 ; 82.79,39.85 82.75,39.81 R86.2 ; 79.26,39.85 79.25,39.84 R85.2 ; 65.27,39.85 65.25,39.83 R81.2 ; 65.27,39.85 61.77,39.85 ; R80.2 61.75,39.84 61.77,39.85 ; R75.2 44.25,39.85 ; R71.2 30.25,39.83 30.24,39.85 ; 103.78,39.85 103.75,39.83 103.75,37.85 ; 103.78,39.85 106.5,39.85 ; R73.2 37.26,39.82 37.23,39.85 ; 54.75,39.85 58.26,39.85 ; 54.75,39.85 54.75,39.84 54.75,37.85 ; 37.23,39.85 33.75,39.85 ; 96.73,39.85 96.75,39.82 R90.2 ; 58.26,39.85 58.25,39.84 58.25,37.85 ; 58.26,39.85 61.77,39.85 ; R87.2 86.25,39.83 86.23,39.85 ; R70.2 26.75,39.84 26.76,39.85 ; 30.24,39.85 33.75,39.85 ; 30.24,39.85 26.76,39.85 ; R82.2 68.75,39.85
  Top Layer w0.5: 3,39.35 3,19.85 4.25,18.6 R63.2 ; v3(106.5,16.65) v3(106.5,17.35) R94.2
  Bottom Layer w0.5: SJ3.1 v3(106.5,16.65)
$1N30161: length 2.2
  Bottom Layer w0.254: IR31.2 105.87,37.73 R95.1
$1N30166: length 2.2
  Bottom Layer w0.254: IR32.2 105.87,27.23 R97.1

## Copper pours and planes (outline as drawn; the poured copper is in the pictures)
+5V on Bottom Layer: 26.5,12.1 32.5,12.1 32.5,8.35 26.5,8.35
AGND on Top Layer: -2,45.35 113.5,45.35 113.5,-2.65 -2,-2.65
AGND on Bottom Layer: 18.5,11.88 24.5,11.88 24.5,8.12 18.5,8.12
AGND on Bottom Layer: -2,46.35 113.5,46.35 113.5,-1.65 -2,-1.65
VCC on Bottom Layer: 63.81,20.04 65.19,20.04 65.19,18.66 63.81,18.66
VCC on Bottom Layer: 10.5,11.88 16.5,11.88 16.5,8.12 10.5,8.12

## Text on the board
Top Silkscreen Layer: JLCJLCJLCJLC | 3,3V | GND | 5V | Sensor board V1 | MVTT | Bez konektoru / To nepojde :(
